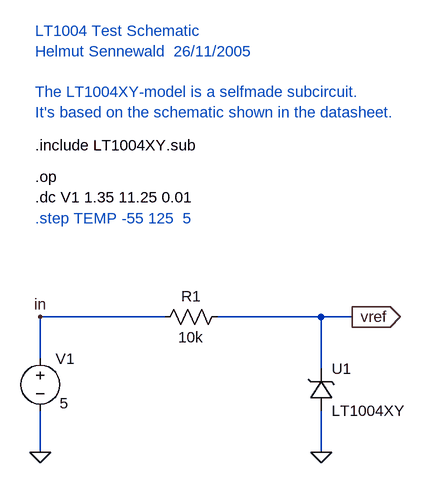
[diagram p0: schematic LT1004_test1.asc]
LT1004_test1.asc, the LTspice schematic file:
Version 4
SHEET 1 1684 1700
WIRE -336 192 -336 128
WIRE -336 336 -336 272
WIRE -144 128 -336 128
WIRE 96 128 -64 128
WIRE 96 208 96 128
WIRE 96 336 96 272
WIRE 144 128 96 128
FLAG -336 336 0
FLAG -336 128 in
FLAG 96 336 0
FLAG 144 128 vref
IOPIN 144 128 Out
SYMBOL res -160 144 R270
WINDOW 0 32 56 VTop 0
WINDOW 3 0 56 VBottom 0
SYMATTR InstName R1
SYMATTR Value 10k
SYMBOL voltage -336 176 R0
WINDOW 123 24 132 Left 0
WINDOW 39 0 0 Left 0
WINDOW 3 30 85 Left 0
SYMATTR InstName V1
SYMATTR Value 5
SYMBOL xref2 80 208 R0
SYMATTR InstName U1
SYMATTR Value LT1004XY
TEXT -344 -88 Left 0 !.op
TEXT -344 -56 Left 0 !.dc V1 1.35 11.25 0.01
TEXT -344 -24 Left 0 ;.step TEMP -55 125  5
TEXT -344 -312 Left 0 ;LT1004 Test Schematic\nHelmut Sennewald  26/11/2005\n \nThe LT1004XY-model is a selfmade subcircuit.\nIt's based on the schematic shown in the datasheet.
TEXT -344 -136 Left 0 !.include LT1004XY.sub

The netlist it stands for:
* LT1004_test1.asc
R1 in vref 10k
V1 in 0 5
XU1 0 vref LT1004XY  ; pins A K
.op
.dc V1 1.35 11.25 0.01
* .step TEMP -55 125  5
* LT1004 Test Schematic
* Helmut Sennewald  26/11/2005
* The LT1004XY-model is a selfmade subcircuit.
* It's based on the schematic shown in the datasheet.
.include LT1004XY.sub
.backanno
.end